# Altium project DCCRegulator.PrjPCB
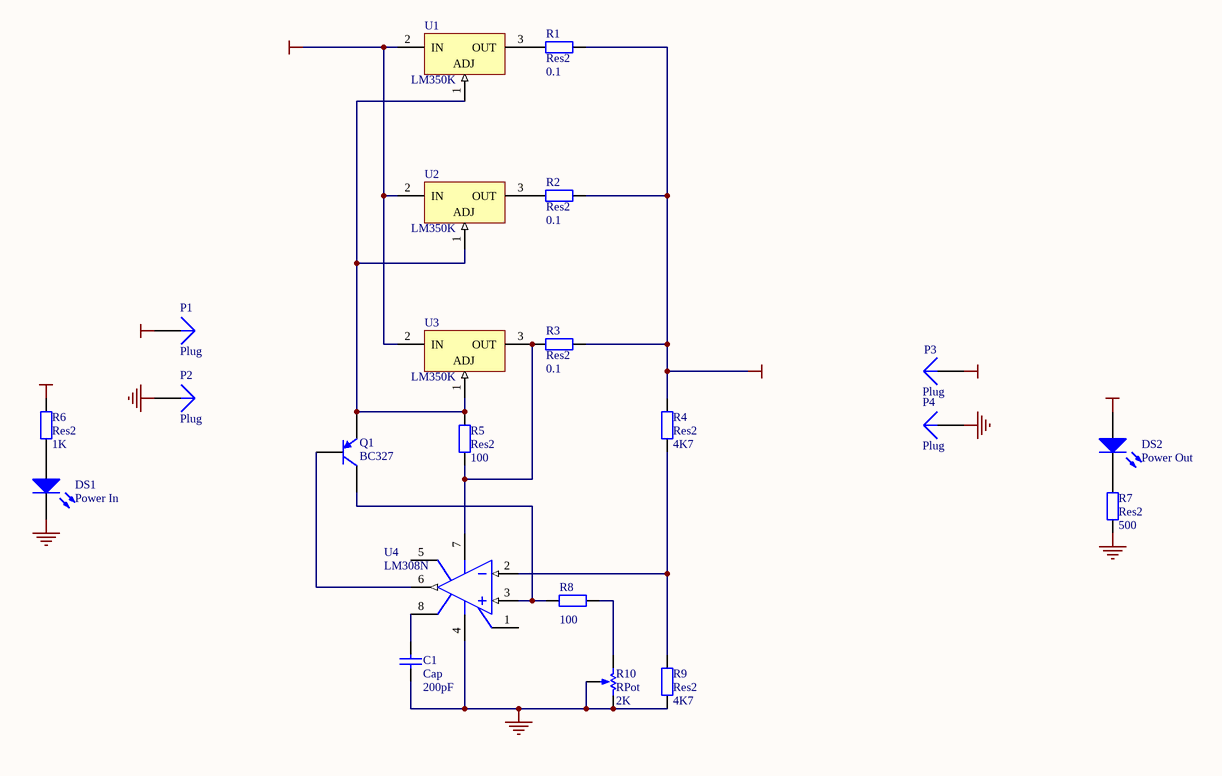
[diagram p0: DCCRegulator.SchDoc]
1 sheet, 22 parts. Net scope: global (net labels, ports and power ports of the same name join across sheets).

## Sheet DCCRegulator.SchDoc
size A4

### Parts
C1  Cap  value 200pF  [RAD-0.2]
DS1  Power In  [LED5mm]
DS2  Power Out  [LED5mm]
P1  Plug  [PIN1]
P2  Plug  [PIN1]
P3  Plug  [PIN1]
P4  Plug  [PIN1]
Q1  BC327  [29-04]
R1  Res2  value 0.1  [AXIAL-1.0]
R2  Res2  value 0.1  [AXIAL-1.0]
R3  Res2  value 0.1  [AXIAL-1.0]
R4  Res2  value 4K7  [AXIAL-0.3]
R5  Res2  value 100  [AXIAL-0.3]
R6  Res2  value 1K  [AXIAL-0.3]
R7  Res2  value 500  [AXIAL-0.3]
R8  value 100  [AXIAL-0.3]  (hidden comment: Res2)
R9  Res2  value 4K7  [AXIAL-0.3]
R10  RPot  value 2K  [Horizontal Trim Pot]
U1  LM350K  [1-03]
U2  LM350K  [1-03]
U3  LM350K  [1-03]
U4  LM308N  [626-05]

### Nets
GND: C1.1 DS1.2(K) P2.1 P4.1 R7.1 R9.1 R10.1(TOP) R10.3(TAP) U4.4(V-)
Vin: P1.1 R6.2 U1.2(IN) U2.2(IN) U3.2(IN)
Vout: DS2.1(A) P3.1 R1.2 R2.2 R3.2 R4.2
NetC1_2: C1.2 U4.8(CMPEN_2)
NetDS1_1: DS1.1(A) R6.1
NetDS2_2: DS2.2(K) R7.2
NetQ1_1: Q1.1(C) R8.2 U4.3(IN+)
NetQ1_2: Q1.2(B) U4.6(OUT)
NetQ1_3: Q1.3(E) R5.2 U1.1(ADJ) U2.1(ADJ) U3.1(ADJ)
NetR1_1: R1.1 U1.3(OUT)
NetR2_1: R2.1 U2.3(OUT)
NetR3_1: R3.1 R5.1 U3.3(OUT) U4.7(V+)
NetR4_1: R4.1 R9.2 U4.2(IN-)
NetR8_1: R8.1 R10.2(BOT)

Not connected (* = marked no-connect by the designer): U4 1(CMPEN_1) 5(NC)

### Library data of the parts
C1 = Cap: Capacitor; Published: 8-Jun-2000; Revision: July-2002: Re-released for DXP Platform.; Publisher: Altium Limited
DS1 DS2 = LED0: Typical INFRARED GaAs LED; Published: 8-Jun-2000; Revision: July-2002: Re-released for DXP Platform.; Publisher: Altium Limited
Q1 = BC327: Amplifier Transistor PNP Silicon; Package Information: Latest Revision: 1996; Published: 29-Sep-2000; Revision: 17-Jul-2002: Re-released for DXP Platform.; Datasheet: Latest Revision: 1996; Package Reference: 29-04; Publisher: Altium Limited
R1-R9 = Res2: Resistor; Published: 8-Jun-2000; Revision: July-2002: Re-released for DXP Platform.; Publisher: Altium Limited
R10 = RPot: Potentiometer; Set Position: 0.5; Published: 8-Jun-2000; Revision: July-2002: Re-released for DXP Platform.; Publisher: Altium Limited
U1-U3 = LM350K: 3-Terminal Adjustable Positive Voltage Regulator; Note: Pins 1 & 2 are electrically isolated from case.  Case is 3rd elecrical connection.; Published: 17-Jul-2002; Datasheet: Linear and Interface Integrated Circuits, DL128 Rev2 (1988); Package Reference: 1-03; Publisher: Altium Limited
U4 = LM308N: Precision Operational Amplifier; Published: 17-Jul-2002; Datasheet: Linear and Interface Integrated Circuits, DL128 Rev2 (1988); Package Reference: 626-05; Publisher: Altium Limited
P1-P4 = Plug: Revision: 17-Jul-2002: Re-released for DXP Platform.; Publisher: Altium Limited